# EAGLE design OpenCTD-V04 (EAGLE 8.5.2)
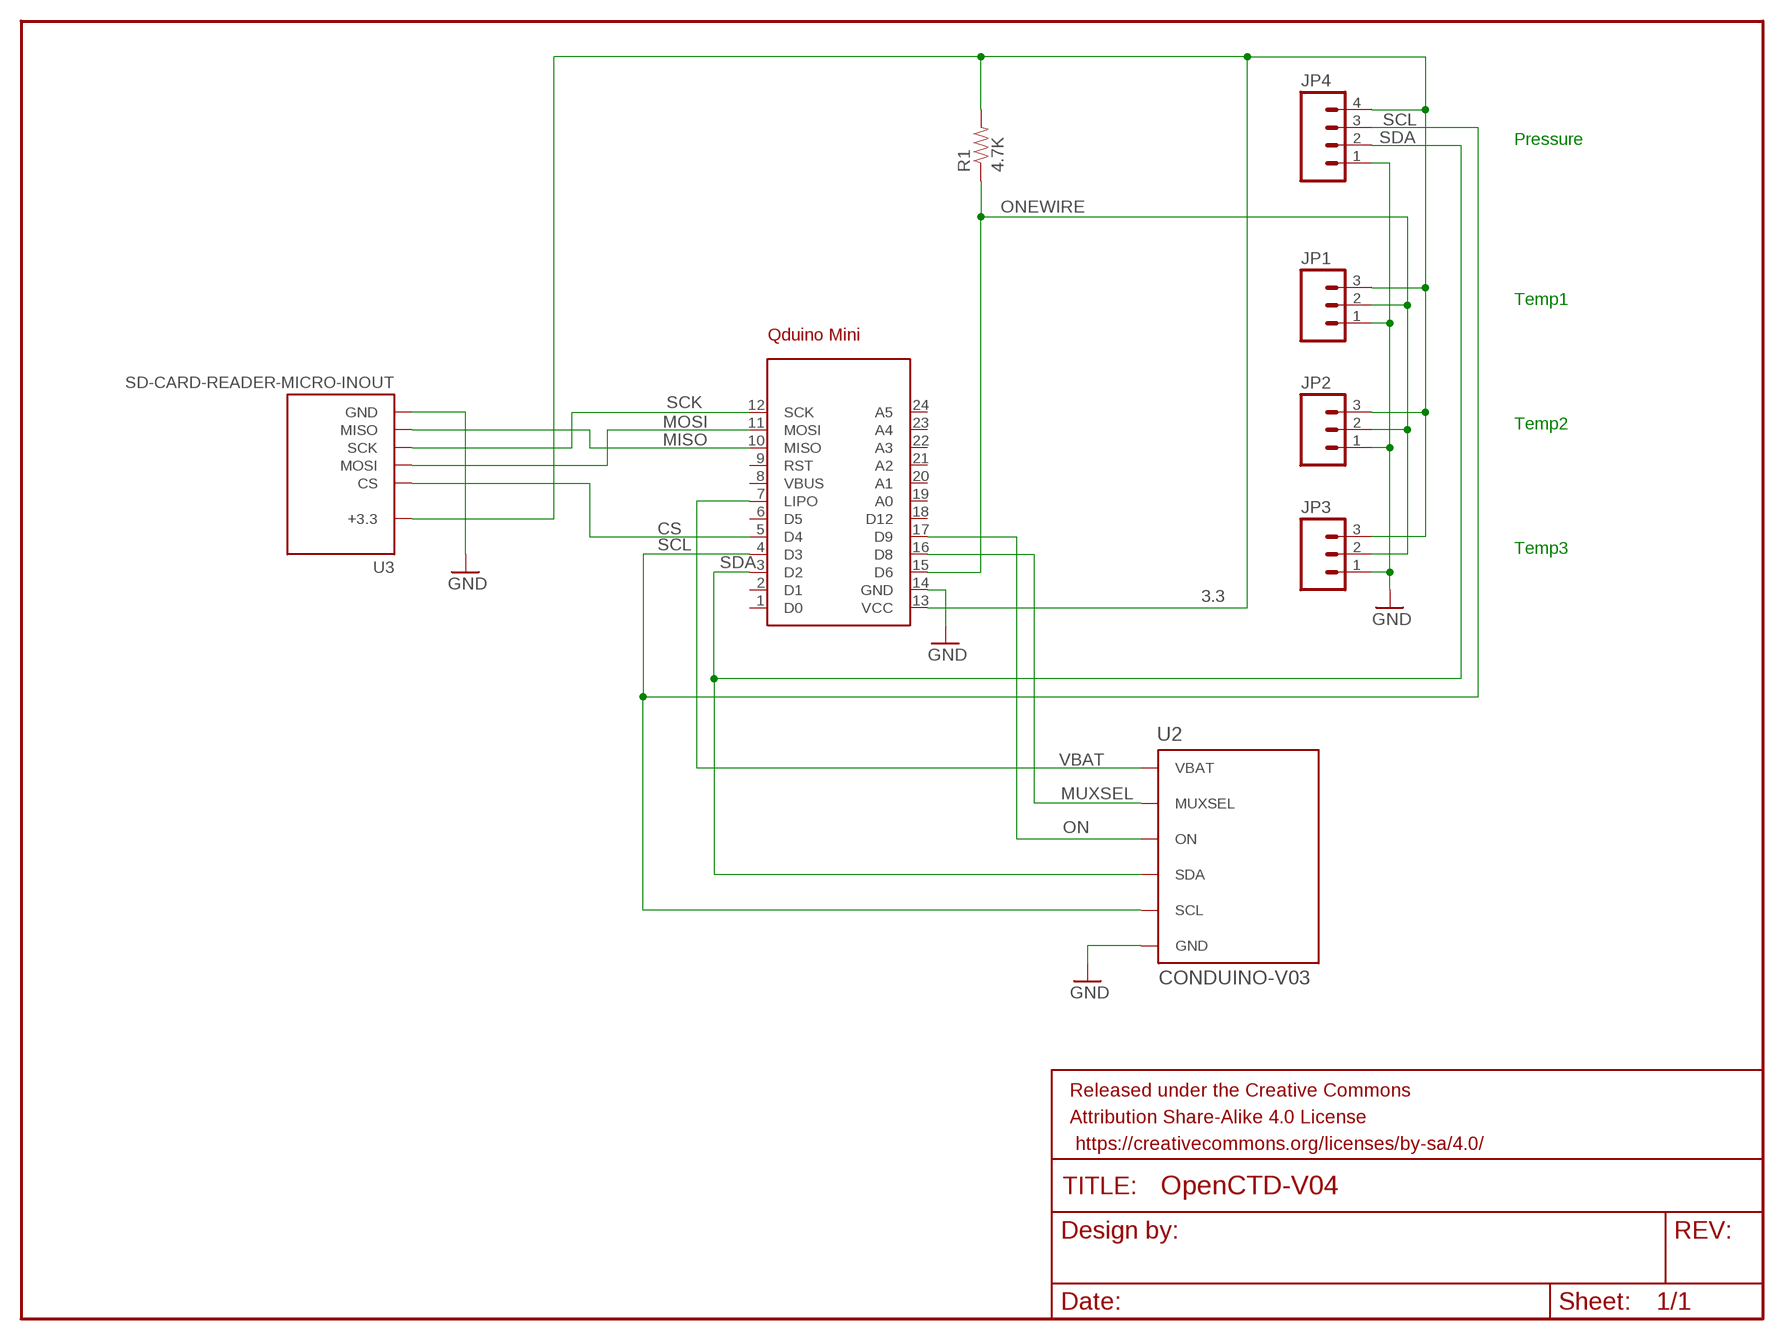
[diagram p0: schematic, sheet 1]

## Parts
FRAME1  FRAME-LETTER  [CREATIVE_COMMONS]
JP1  M031X03_NO_SILK  [1X03_NO_SILK]
JP2  M031X03_NO_SILK  [1X03_NO_SILK]
JP3  M031X03_NO_SILK  [1X03_NO_SILK]
JP4  M041X04_NO_SILK  [1X04_NO_SILK]
R1  4.7K  RESISTORPTH-1/4W  [AXIAL-0.4]
U1  QDUINO_MINI  [QDUINO_MINI]
U2  CONDUINO-V03  [CONDUINO_V03]
U3  SD-CARD-READER-MICRO-INOUT  [SD-CARD-READER-105162]

## Nets
3.3: JP1.3 JP2.3 JP3.3 JP4.4 R1.P$2 U1.13(VCC) U3.P$4(+3.3)
CS: U1.5(D4) U3.P$2(CS)
GND: JP1.1 JP2.1 JP3.1 JP4.1 U1.14(GND) U2.5(GND) U3.G1(GND) U3.G2(GND) U3.G3(GND) U3.G4(GND) U3.P$6(GND)
MISO: U1.10(MISO) U3.P$7(MISO)
MOSI: U1.11(MOSI) U3.P$3(MOSI)
MUXSEL: U1.16(D8) U2.4(MUXSEL)
ON: U1.17(D9) U2.3(ON)
ONEWIRE: JP1.2 JP2.2 JP3.2 R1.P$1 U1.15(D6)
SCK: U1.12(SCK) U3.P$5(SCK)
SCL: JP4.3 U1.4(D3) U2.1(SCL)
SDA: JP4.2 U1.3(D2) U2.2(SDA)
VBAT: U1.7(LIPO) U2.6(VBAT)
Unconnected: U1.1(D0) U1.2(D1) U1.6(D5) U1.8(VBUS) U1.9(RST) U1.18(D12) U1.19(A0) U1.20(A1) U1.21(A2) U1.22(A3) U1.23(A4) U1.24(A5)

## Notes on the sheet
- Pressure
- Temp1
- Temp2
- Temp3

## Library data of the parts
FRAME1 = SparkFun-Aesthetics:FRAME-LETTER: Schematic Frame Standard 8.5x11 US Letter frame
JP1-JP3 = SparkFun-Connectors:M03: Header 3 Standard 3-pin 0.1" header. Use with straight break away headers (SKU : PRT-00116), right angle break away headers (PRT-00553), swiss pins (PRT-00743), machine pins (PRT-00117), and female headers (PRT-00115). Molex polarized connector foot print use with SKU : PRT-08232 with associated crimp pins and housings.
JP4 = SparkFun-Connectors:M04: Header 4 Standard 4-pin 0.1" header. Use with straight break away headers (SKU : PRT-00116), right angle break away headers (PRT-00553), swiss pins (PRT-00743), machine pins (PRT-00117), and female headers (PRT-00115). Molex polarized connector foot print use with SKU : PRT-08231 with associated crimp pins and housings. 1MM SMD Version SKU: PRT-10208
R1 = SparkFun-Resistors:RESISTOR: Resistor Basic schematic elements and footprints for 0603, 1206, and PTH resistors.
U1 = SparkFun-Boards:QDUINO_MINI
U2 = KDA:CONDUINO-V03
U3 = KDA:SD-CARD-READER-MICRO-INOUT

## Board
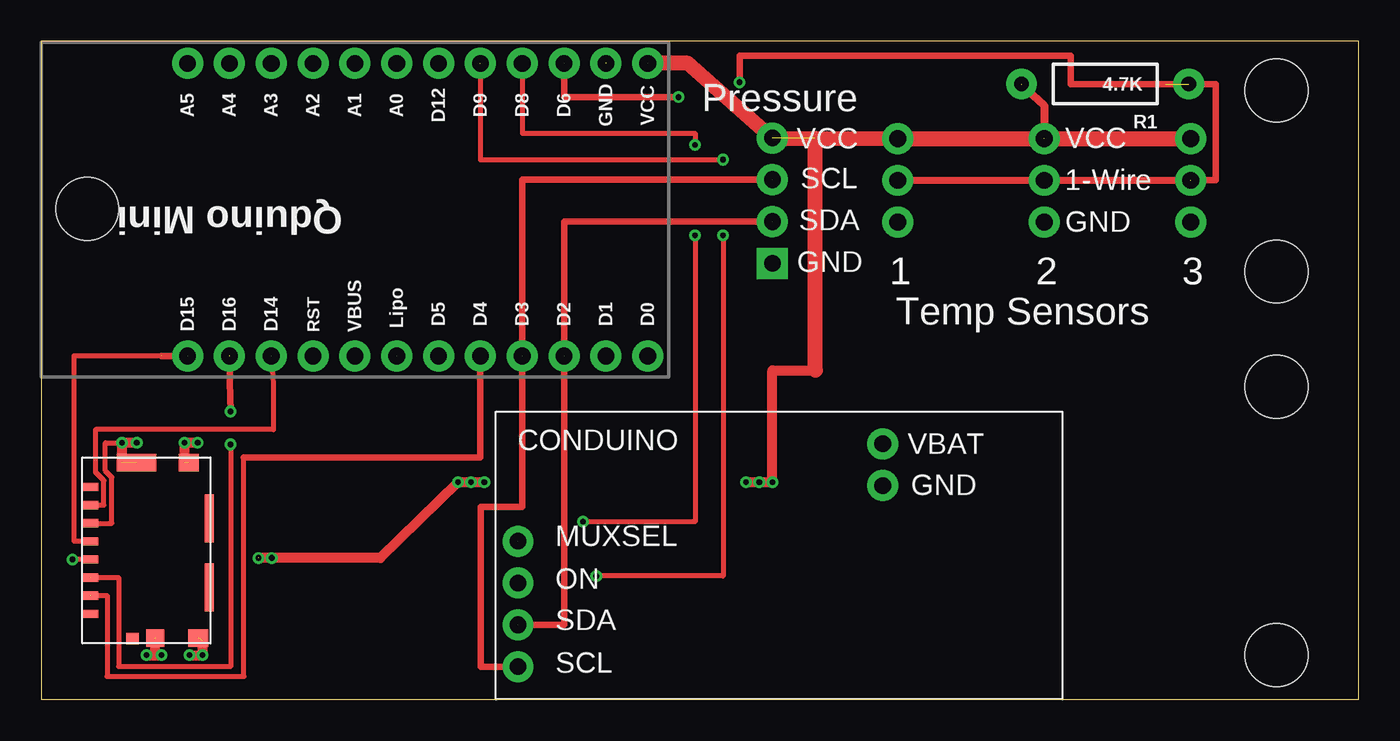
[diagram p1: board, top side]
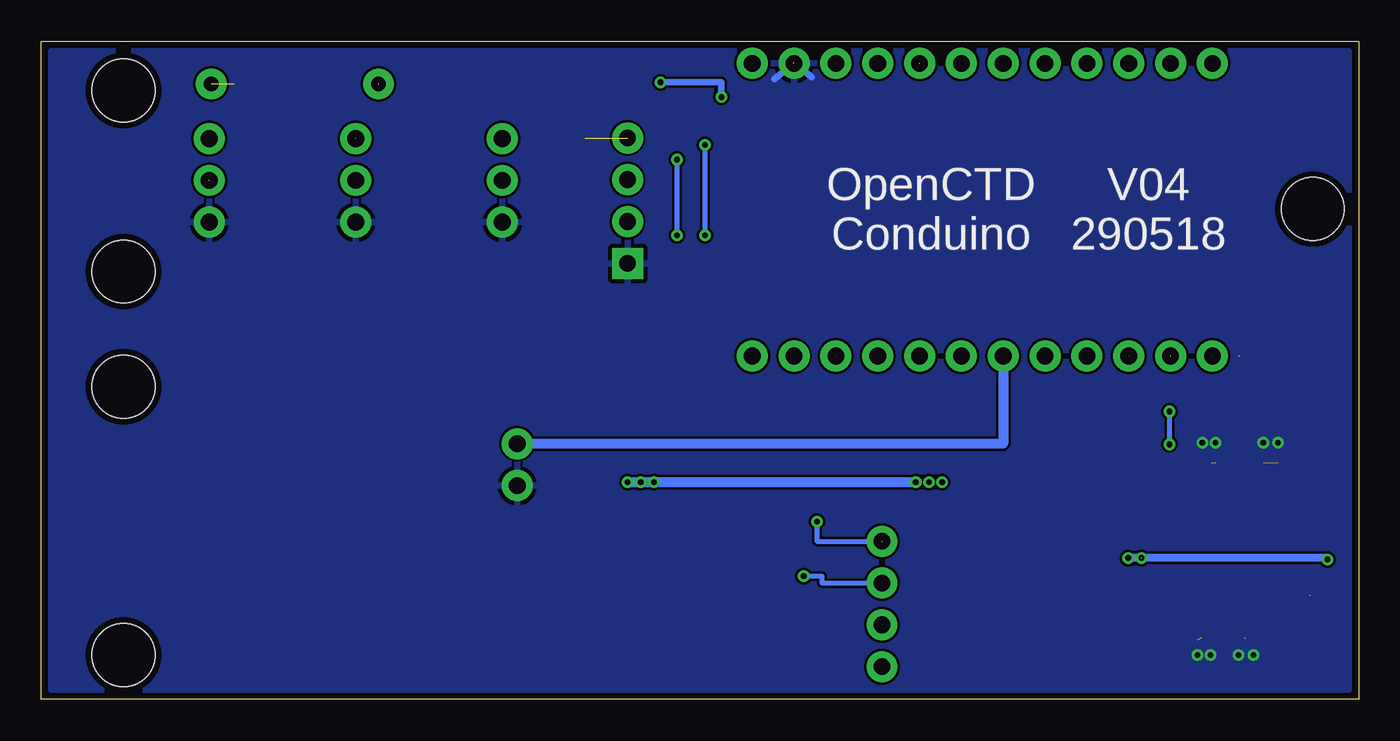
[diagram p2: board, bottom side, seen from below]

Size 80 x 40 mm. Coordinates in mm from the lower left corner, seen from the top.
Outline: 0,0 80,0 80,40 0,40 0,0
Copper layers (1*16): Top 0.0356mm / dielectric 1.5011mm / Bottom 0.0356mm
Design rules "Oshpark_mm": minimum track width 0.15mm, minimum drill 0.33mm, track to track 0.15mm, track to pad 0.15mm, pad to pad 0.15mm, via to via 0.15mm, smd to smd 0.15mm, copper to edge 0.38mm, drill to drill 0.15mm, minimum pad ring 7mil, minimum via ring 7mil, stop-mask expansion 3mil, vias tented up to drill 0mil, thermal gap 10mil
Holes 3.81 mm at 75,37 75,26 75,19 75,2.7 2.8,29.8

### Footprints (pad centres in the part's own frame; a part is rotated, then mirrored left to right if it is on the bottom)
1X03_NO_SILK = drill 1.016 pad 1.88: 1 0,0; 2 2.54,0; 3 5.08,0
1X04_NO_SILK = drill 1.016 pad 1.88 square: 1 0,0 | drill 1.016 pad 1.88: 2 2.54,0; 3 5.08,0; 4 7.62,0
AXIAL-0.4 = drill 0.9 pad 1.88: P$1 -5.08,0; P$2 5.08,0
QDUINO_MINI = drill 1.016 pad 1.88: 1 1.27,1.27; 2 1.27,3.81; 3 1.27,6.35; 4 1.27,8.89; 5 1.27,11.43; 6 1.27,13.97; 7 1.27,16.51; 8 1.27,19.05; 9 1.27,21.59; 10 1.27,24.13; 11 1.27,26.67; 12 1.27,29.21; 13 19.05,1.27; 14 19.05,3.81; 15 19.05,6.35; 16 19.05,8.89; 17 19.05,11.43; 18 19.05,13.97; 19 19.05,16.51; 20 19.05,19.05; 21 19.05,21.59; 22 19.05,24.13; 23 19.05,26.67; 24 19.05,29.21
CONDUINO_V03 = drill 1.016 pad 1.88: 1 1.35,2; 2 1.35,4.54; 3 1.35,7.08; 4 1.35,9.62; 5 23.5,13; 6 23.5,15.54
SD-CARD-READER-105162 = smd 1.05 x 1.08: G1 5.325,4.45 | smd 1.05 x 1.2: G2 5.325,7.06; G3 -5.325,6.49 | smd 1.05 x 2.39: G4 -5.325,3.305 | smd 0.5 x 1: P$1 3.85,0.5; P$2 2.75,0.5; P$3 1.65,0.5; P$4 0.55,0.5; P$5 -0.55,0.5; P$6 -1.65,0.5; P$7 -2.75,0.5; P$8 -3.85,0.5 | smd 0.72 x 0.78: P$9 5.36,3.07 | smd 2.91 x 0.55: P$10 -1.945,7.735; P$11 2.245,7.735

### Placement (x,y rotation side)
FRAME1  0,0 0 top
JP1  69.8,29 90 top
JP2  52,29 90 top
JP3  60.9,29 90 top
JP4  44.4,26.5 90 top
R1  64.6,37.4 180 top
U1  38.1,19.6 90 top
U2  27.6,0 0 top
U3  2.48,9.06 270 top

### Tracks (layer width: path | path; a pad name or v marks a point on that pad's centre or on a via)
3.3  (via drill 0.35)  (6 unrouted)
  Top 0.3: U3.P$4 v1.9,8.51
  Top 0.5: R1.P$2 60.9,36.11 60.9,34.1
  Top 0.6: v26.9,13.2 v26.1,13.2 v25.3,13.2 20.6,8.6 v13.19,8.6 | v42.8,13.2 v43.6,13.2 v44.4,13.2 44.4,20 47,20
  Top 0.9: JP4.4 JP2.3 JP3.3 JP1.3 | JP4.4 39.27,38.65 U1.13 | 47,20 47,34.1
  Bottom 0.5: v1.9,8.51 2,8.6 v13.2,8.6 v14,8.6
  Bottom 0.6: v26.9,13.2 v42.8,13.2 v43.6,13.2 v44.4,13.2
CS  (1 unrouted)
  Top 0.3: U3.P$2 4,6.32 4,1.4 12.3,1.4 12.3,14.7
  Top 0.4: 12.3,14.7 26.67,14.7 U1.5
GND  (via drill 0.35)  (5 unrouted)
  Top 0.3: U3.P$6 4.3,10.71 4.3,13.5 3.9,13.9 3.9,15.6 v4.9,15.6
  Top 0.6: v5.8,15.6 v4.9,15.6 4.9,14.4 | v9.5,15.6 v8.7,15.6 8.7,14.4 | v9,2.7 v9.8,2.7 9.8,3.6 | v6.4,2.7 6.9,2.7 | 6.9,2.7 v7.3,2.7 | 6.9,3.7 6.9,2.7
  Bottom 0.4: 34.3,38.7 33.2,37.8 | 34.3,38.67 35.5,37.7
  pour Bottom (isolate 0.13): 0.6,0.6 0.6,39.4 79.4,39.4 79.4,0.6
MISO  (1 unrouted)
  Top 0.3: U3.P$7 3.8,11.81 3.8,13.3 3.3,13.8 3.3,16.4 14.1,16.4 14.1,19.2 U1.10
MOSI  (via drill 0.35)  (2 unrouted)
  Top 0.3: U3.P$3 4.7,7.42 4.7,2 11.5,2 v11.5,15.5
  Top 0.4: v11.5,17.5 11.44,19.3 U1.11
  Bottom 0.3: v11.5,17.5 v11.5,15.5
MUXSEL  (via drill 0.35)  (1 unrouted)
  Top 0.3: U1.16 29.21,34.4 39.7,34.4 v39.7,33.7 | v39.7,28.2 39.7,10.8 v32.9,10.8
  Bottom 0.3: v39.7,33.7 v39.7,28.2 | v32.9,10.8 32.9,9.62 U2.4
ON  (via drill 0.35)  (1 unrouted)
  Top 0.3: 26.67,38.63 26.67,32.8 v41.4,32.8 | v41.4,28.2 41.4,7.5 v33.7,7.5
  Bottom 0.3: v41.4,32.8 v41.4,28.2 | v33.7,7.5 32.6,7.5 32.6,7.08 U2.3
ONEWIRE  (via drill 0.35)  (4 unrouted)
  Top 0.4: JP1.2 71.3,31.55 71.3,37.4 68.28,37.4 | 68.3,37.4 62.5,37.4 62.5,39.1 42.4,39.1 v42.4,37.5 | U1.15 31.76,36.6 v38.7,36.6
  Top 0.42: JP1.2 JP3.2 JP2.2
  Bottom 0.4: v38.7,36.6 38.7,37.5 v42.4,37.5
SCK  (2 unrouted)
  Top 0.3: U3.P$5 2,9.61 2,20.9 7.3,20.9
  Top 0.4: 7.3,20.88 U1.12
SCL  (2 unrouted)
  Top 0.4: U1.4 29.21,31.58 JP4.3 | U1.4 29.21,11.7 26.7,11.7 26.7,2 U2.1
SDA  (4 unrouted)
  Top 0.4: JP4.2 31.75,29.04 U1.3 | U1.3 31.76,4.54 U2.2
VBAT  (1 unrouted)
  Bottom 0.6: U1.7 21.59,15.54 U2.6

### Text on the board
tPlace: Pressure | VCC | VCC | SCL | 1-Wire | SDA | GND | GND | 1 | 2 | 3 | Temp Sensors
bPlace: V04 / 290518 | OpenCTD / Conduino